# EAGLE design smd_basic_dual_powerb (EAGLE 5.06)
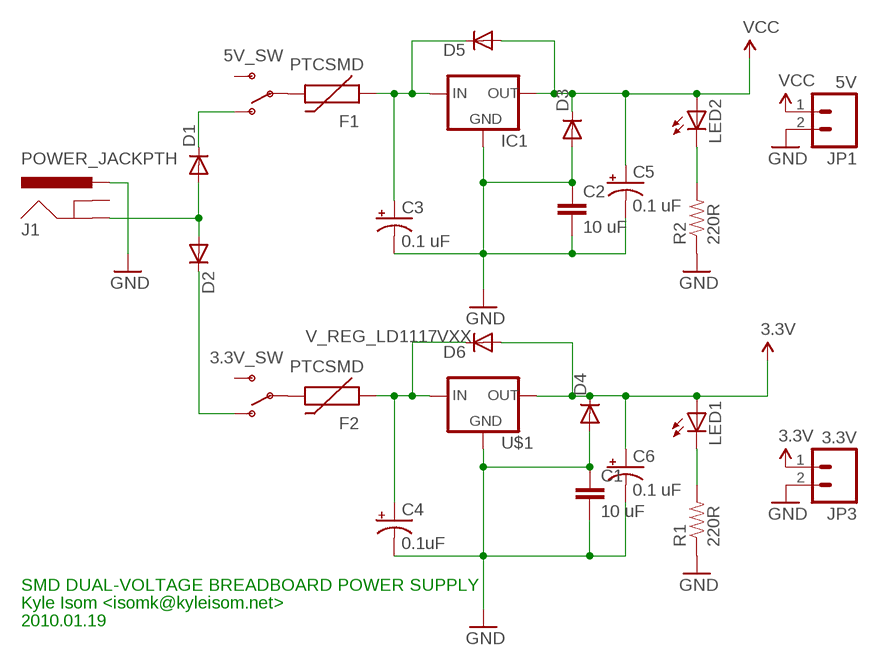
[diagram p0: schematic, sheet 1]

## Parts
3.3V_SW  SWITCH-SPSTPTH  [SWITCH-SPDT]
5V_SW  SWITCH-SPSTPTH  [SWITCH-SPDT]
C1  10 uF  CAP0603-CAP  [0603-CAP]
C2  10 uF  CAP0603-CAP  [0603-CAP]
C3  0.1 uF  CAP_POL1206  [EIA3216]
C4  0.1uF  CAP_POL1206  [EIA3216]
C5  0.1 uF  CAP_POL1206  [EIA3216]
C6  0.1 uF  CAP_POL1206  [EIA3216]
D1  DIODESOD  [SOD-323]
D2  DIODESOD  [SOD-323]
D3  DIODESOD  [SOD-323]
D4  DIODESOD  [SOD-323]
D5  DIODESOD  [SOD-323]
D6  DIODESOD  [SOD-323]
F1  PTCSMD  [PTC-1206]
F2  PTCSMD  [PTC-1206]
IC1  V_REG_78XXSIDE  [78XXL]
J1  POWER_JACKPTH  [POWER_JACK_PTH]
JP1  5V  M02  [1X02_LONGPADS]
JP3  3.3V  M02  [1X02_LONGPADS]
LED1  LEDCHIP-LED0603  [CHIP-LED0603]
LED2  LEDCHIP-LED0603  [CHIP-LED0603]
R1  220R  RESISTOR0603-RES  [0603-RES]
R2  220R  RESISTOR0603-RES  [0603-RES]
U$1  V_REG_LD1117VXX  [78XXL]

## Nets
3.3V: C6.A(+) D4.1(C) D6.2(A) JP3.1 LED1.A U$1.GND(OUT)
GND: C1.1 C1.2 C2.1 C2.2 C3.C(-) C4.C(-) C5.C(-) C6.C(-) D3.2(A) D4.2(A) IC1.GND J1.PWR JP1.2 JP3.2 R1.1 R2.1 U$1.IN(GND)
N$1: D1.2(A) D2.2(A) J1.GND
N$2: 5V_SW.2(P) F1.2
N$3: 3.3V_SW.2(P) F2.2
N$4: 5V_SW.1(O) D1.1(C)
N$5: 3.3V_SW.1(O) D2.1(C)
N$6: C3.A(+) D5.1(C) F1.1 IC1.IN
N$7: C4.A(+) D6.1(C) F2.1 U$1.OUT(IN)
N$12: LED2.C R2.2
N$14: LED1.C R1.2
VCC: C5.A(+) D3.1(C) D5.2(A) IC1.OUT JP1.1 LED2.A
Unconnected: 3.3V_SW.3(S) 5V_SW.3(S) J1.GNDBREAK

## Notes on the sheet
- SMD DUAL-VOLTAGE BREADBOARD POWER SUPPLY
- Kyle Isom <isomk@kyleisom.net>
- 2010.01.19

## Library data of the parts
3.3V_SW 5V_SW = SparkFun:SWITCH-SPST: SPST Switch Simple slide switch. Spark Fun Electronics SKU : COM-00102
C1 C2 = SparkFun:CAP: Capacitor Standard 0603 ceramic capacitor, and 0.1" leaded capacitor.
C3-C6 = SparkFun:CAP_POL: Capacitor Polarized These are standard SMD and PTH capacitors. Normally 10uF, 47uF, and 100uF in electrolytic and tantalum varieties. Always verify the external diameter of the through hole cap, it varies with capacity, voltage, and manufacturer. The EIA devices should be standard.
D1-D6 = SparkFun:DIODE: Diode These are standard reverse protection diodes and small signal diodes. SMA package can handle up to about 1A. SOD-323 can handle about 200mA. What the SOD-323 package when ordering, there are some mfgs out there that are 5-pin packages.
F1 F2 = SparkFun:PTC: Resettable Fuse PTC Resettable Fuse. Spark Fun Electronics SKU : COM-08357
IC1 = SparkFun:V_REG_78XX: Voltage Regulator Standard 7805 5V regulator. IGO (Input Ground Output). Spark Fun Electronics SKU : COM-00107
J1 = SparkFun:POWER_JACK: Power Jack This is the standard 5.5mm barrel jack for power. The PTH is the most common, proven, reliable, footprint. All others are experimental. The Slot footprint only works if the mill layer is transmitted to the PCB fab house so be warned. Spark Fun Electronics SKU : PRT-00119. Mating wall wart : TOL-00298 (and others)
JP1 JP3 = SparkFun:M02: Header 2 Standard 2-pin 0.1" header. Use with straight break away headers (SKU : PRT-00116), right angle break away headers (PRT-00553), swiss pins (PRT-00743), machine pins (PRT-00117), and female headers (PRT-00115). Molex polarized connector foot print use with SKU : PRT-08233 with associated crimp pins and housings.
LED1 LED2 = led:LED: LED OSRAM: - CHIPLED LG R971, LG N971, LY N971, LG Q971, LY Q971, LO R971, LY R971 LH N974, LH R974 LS Q976, LO Q976, LY Q976 LO Q996 - Hyper CHIPLED LW Q18S LB Q993, LB Q99A, LB R99A - SideLED LS A670, LO A670, LY A670, LG A670, LP A670 LB A673, LV A673, LT A673, LW A673 LH A674 LY A675 LS A676, LA A676, LO A676, LY A676, LW A676 LS A679, LY A679, LG A679 - Hyper Micro SIDELED® LS Y876, LA Y876, LO Y876, LY Y876 LT Y87S - SmartLED LW L88C, LW L88S LB L89C, LB L89S, LG L890 LS L89K, LO L89K, LY L89K LS L896, LA L896, LO L896, LY L896 - TOPLED LS T670, LO T670, LY T670, LG T670, LP T670 LSG T670, LSP T670, LSY T670, LOP T670, LYG T670 LG T671, LOG T671, LSG T671 LB T673, LV T673, LT T673, LW T673 LH T674 LS T676, LA T676, LO T676, LY T676, LB T676, LH T676, LSB T676, LW T676 LB T67C, LV T67C, LT T67C, LS T67K, LO T67K, LY T67K, LW E67C LS E67B, LA E67B, LO E67B, LY E67B, LB E67C, LV E67C, LT E67C LW T67C LS T679, LY T679, LG T679 LS T770, LO T770, LY T770, LG T770, LP T770 LB T773, LV T773, LT T773, LW T773 LH T774 LS E675, LA E675, LY E675, LS T675 LS T776, LA T776, LO T776, LY T776, LB T776 LHGB T686 LT T68C, LB T68C - Hyper Mini TOPLED® LB M676 - Mini TOPLED Santana® LG M470 LS M47K, LO M47K, LY M47K Source: http://www.osram.convergy.de LUXEON: - LUMILED® LXK2-PW12-R00, LXK2-PW12-S00, LXK2-PW14-U00, LXK2-PW14-V00 LXK2-PM12-R00, LXK2-PM12-S00, LXK2-PM14-U00 LXK2-PE12-Q00, LXK2-PE12-R00, LXK2-PE12-S00, LXK2-PE14-T00, LXK2-PE14-U00 LXK2-PB12-K00, LXK2-PB12-L00, LXK2-PB12-M00, LXK2-PB14-N00, LXK2-PB14-P00, LXK2-PB14-Q00 LXK2-PR12-L00, LXK2-PR12-M00, LXK2-PR14-Q00, LXK2-PR14-R00 LXK2-PD12-Q00, LXK2-PD12-R00, LXK2-PD12-S00 LXK2-PH12-R00, LXK2-PH12-S00 LXK2-PL12-P00, LXK2-PL12-Q00, LXK2-PL12-R00 Source: www.luxeon.com KINGBRIGHT: KA-3528ASYC Source: www.kingbright.com
R1 R2 = SparkFun:RESISTOR: Resistor Basic schematic elements and footprints for 0603, 1206, and PTH 1/10th watt (small) resistors.
U$1 = SparkFun:V_REG_LD1117VXX: LD1117VXX voltage regulator. We carry the 3.3V version (COM-00526) in TO-220 package.

## Board
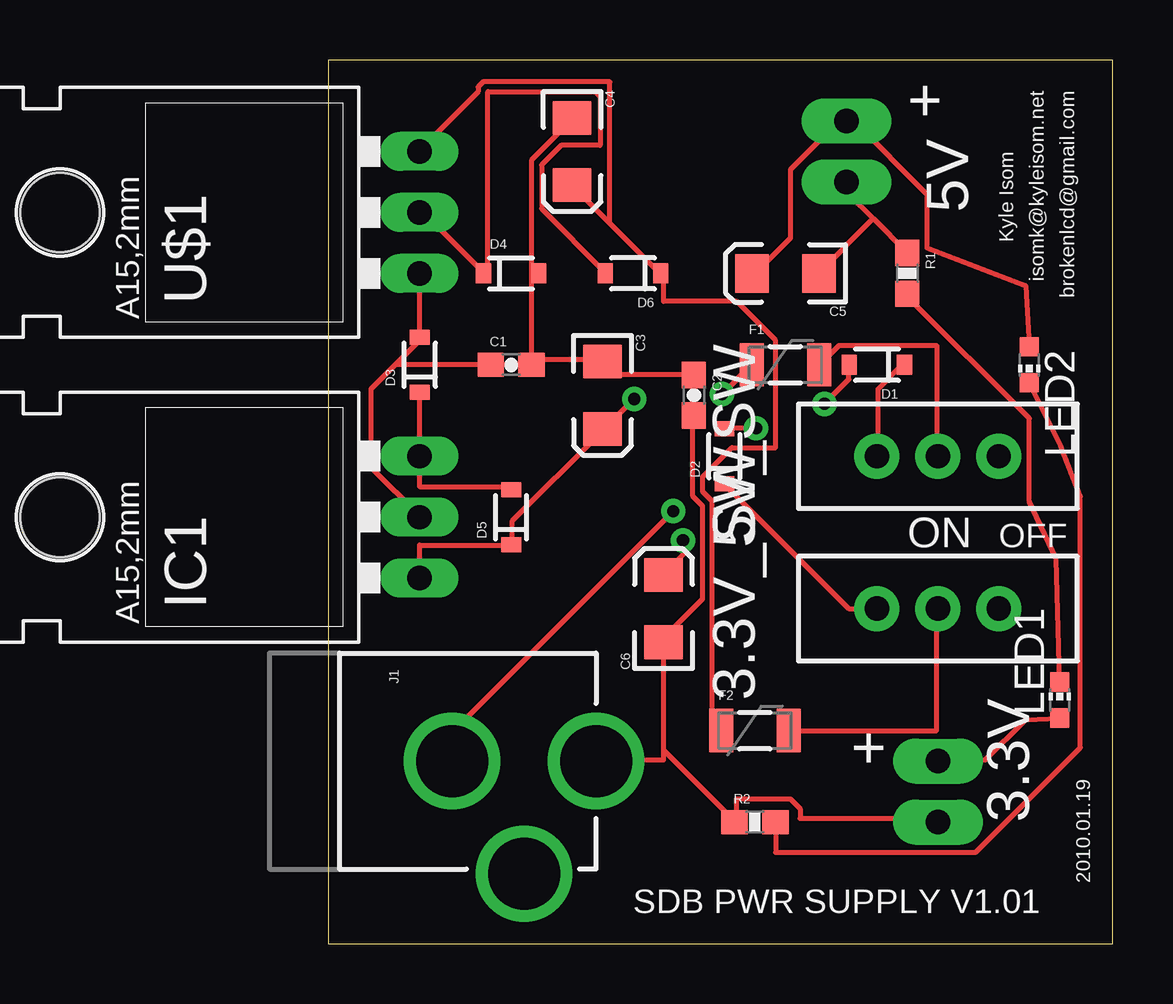
[diagram p1: board, top side]
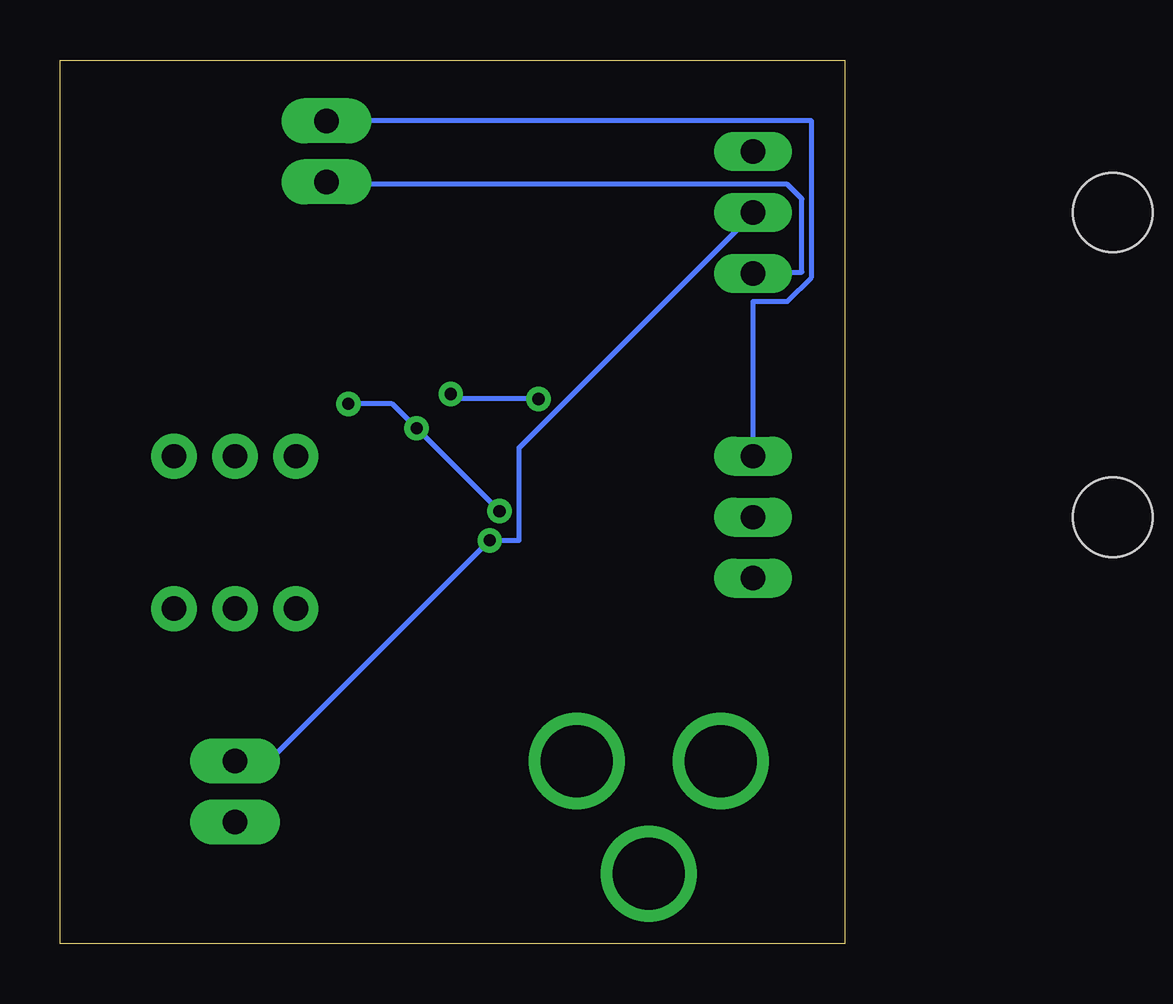
[diagram p2: board, bottom side, seen from below]

Size 32.69 x 36.83 mm. Coordinates in mm from the lower left corner, seen from the top.
Outline: 0,0 32.69,0 32.69,36.82 31.75,36.82 31.75,36.83 0,36.82 0,0
Copper layers (1*16): Top 0.035mm / dielectric 1.5mm / Bottom 0.035mm
Design rules "SparkFun": minimum track width 8mil, minimum drill 20mil, track to track 8mil, track to pad 8mil, pad to pad 8mil, via to via 8mil, smd to smd 8mil, copper to edge 10mil, drill to drill 8mil, minimum pad ring 12mil, minimum via ring 10mil, stop-mask expansion 4mil, vias tented up to drill 25mil, thermal gap 10mil

### Footprints (pad centres in the part's own frame; a part is rotated, then mirrored left to right if it is on the bottom)
SWITCH-SPDT = drill 1.016 pad 1.88 round: 1 0,2.54; 2 0,0; 3 0,-2.54
0603-CAP = smd 1.1 x 1: 1 -0.85,0; 2 0.85,0
EIA3216 = smd 1.4 x 1.6: A 1.4,0; C -1.4,0
SOD-323 = smd 0.63 x 0.83: 1 -1.15,0; 2 1.15,0
PTC-1206 = smd 1 x 1.8: 1 -1.4,0; 2 1.4,0
78XXL = drill 1.016 long: GND 0,-3.81; IN -2.54,-3.81; OUT 2.54,-3.81 | hole 3.302: 0,11.176
POWER_JACK_PTH = drill 2.997 round: GND 0,7.7; GNDBREAK 4.7,10.7; PWR 0,13.7
1X02_LONGPADS = drill 1.016 pad 1.88 long: 1 0,0; 2 2.54,0
CHIP-LED0603 = smd 0.8 x 0.8: A 0,-0.75; C 0,0.75
0603-RES = smd 1.1 x 1: 1 -0.85,0; 2 0.85,0

### Placement (x,y rotation side)
3.3V_SW  25.4,13.97 90 top
5V_SW  25.4,20.32 90 top
C1  7.62,24.13 0 top
C2  15.24,22.86 270 top
C3  11.43,22.86 270 top
C4  10.16,33.02 270 top
C5  19.05,27.94 180 top
C6  13.97,13.97 90 top
D1  22.86,24.13 180 top
D2  16.51,20.32 90 top
D3  3.81,24.13 90 top
D4  7.62,27.94 0 top
D5  7.62,17.78 90 top
D6  12.7,27.94 180 top
F1  19.05,24.13 0 top
F2  17.78,8.89 0 top
IC1  0,17.78 90 top
J1  -2.54,7.62 270 top
JP1  21.59,34.29 270 top
JP3  25.4,7.62 270 top
LED1  30.48,10.16 0 top
LED2  29.21,24.13 180 top
R1  24.13,27.94 270 top
R2  17.78,5.08 0 top
U$1  0,30.48 90 top

### Tracks (layer width: path | path; a pad name or v marks a point on that pad's centre or on a via)
3.3V  (via drill 0.51)
  Top 0.203: U$1.GND 3.81,30.63 6.45,27.99 D4.1 6.66,27.99 6.66,35.51 11.12,35.51 11.33,35.31 11.33,33.27 9.7,33.27 8.89,32.46 8.89,30.63 11.53,27.99 D6.2 | LED1.A 29.06,9.35 27.38,7.67 25.55,7.67 JP3.1 | v14.78,16.82 14.78,16.2 13.97,15.39 C6.A
  Bottom 0.203: JP3.1 25.35,7.67 23.93,7.67 v14.78,16.82 13.56,16.82 13.56,20.68 3.81,30.43 U$1.GND
GND
  Top 0.203: 13.97,8.08 16.82,5.23 R2.1 17.02,5.23 17.02,6.04 19.25,6.04 19.66,5.64 19.66,5.23 25.35,5.23 JP3.2 | 13.97,8.08 C6.C 13.97,12.75 15.6,14.38 15.6,18.24 15.19,18.64 15.19,21.89 C2.2 15.19,22.1 15.19,23.52 C2.1 15.19,23.72 11.53,23.72 11.53,24.13 C3.C 11.33,24.33 8.48,24.33 | 13.97,8.08 13.97,7.67 9.91,7.67 J1.PWR | 8.48,27.58 8.69,27.79 D4.2 8.48,27.58 | 8.48,24.33 8.48,24.13 C1.2 | 8.48,24.33 8.48,27.58 | C1.2 C1.1 2.79,24.13 | 8.48,24.33 C1.2 | 8.48,27.58 8.48,32.66 10.11,34.29 C4.C | 22.71,30.23 21.69,31.24 21.69,31.65 JP1.2 | 22.71,30.23 24.13,28.8 R1.1 | 22.71,30.23 20.47,27.99 C5.C | U$1.IN D3.2 3.81,25.15 2.79,24.13 | 2.79,24.13 1.78,23.11 1.78,19.86 3.81,17.83 IC1.GND
  Bottom 0.203: JP1.2 21.49,31.65 2.39,31.65 1.78,31.04 1.78,27.99 3.81,27.99 U$1.IN
N$1  (via drill 0.51)
  Top 0.203: v17.83,21.49 16.61,21.49 D2.2 | v20.68,22.5 21.69,23.52 21.69,24.13 D1.2 | v14.38,18.03 4.01,7.67 J1.GND
  Bottom 0.203: v20.68,22.5 18.85,22.5 v17.83,21.49 v14.38,18.03
N$2
  Top 0.203: F1.2 20.47,24.13 21.29,24.94 25.35,24.94 25.35,20.47 5V_SW.2
N$3
  Top 0.203: F2.2 25.35,8.89 25.35,13.97 3.3V_SW.2
N$4
  Top 0.203: D1.1 23.93,24.13 22.91,23.11 22.91,20.47 5V_SW.1
N$5
  Top 0.203: D2.1 16.61,19.05 21.69,13.97 3.3V_SW.1
N$6  (via drill 0.51)
  Top 0.203: IC1.IN 3.81,16.61 7.47,16.61 D5.1 7.67,16.82 7.67,17.63 11.33,21.29 C3.A 11.53,21.49 v12.75,22.71 | v16.41,22.91 17.63,24.13 F1.1
  Bottom 0.203: v16.41,22.91 16.2,22.71 v12.75,22.71
N$7
  Top 0.203: 11.73,30.02 10.31,31.45 C4.A | 11.73,30.02 13.77,27.99 D6.1 13.97,27.79 13.97,26.77 17.02,26.77 18.64,25.15 18.64,20.68 16.82,20.68 15.6,19.46 15.6,18.85 16,18.44 16,9.09 16.2,8.89 F2.1 | 11.73,30.02 11.73,35.92 6.45,35.92 6.25,35.71 6.25,35.51 3.81,33.07 U$1.OUT
N$12
  Top 0.203: LED2.C 30.53,20.73 31.34,18.64 31.34,8.18 26.98,3.81 18.64,3.81 18.64,5.03 R2.2
N$14
  Top 0.203: LED1.C 30.33,16.05 29.21,18.44 29.21,21.89 24.13,26.98 R1.2
VCC
  Top 0.203: D3.1 IC1.OUT 3.81,19.05 7.47,19.05 D5.2 | LED2.A 29.06,27.43 24.94,29.01 24.94,31.24 21.89,34.29 JP1.1 21.29,34.29 19.25,32.26 19.25,29.41 17.83,27.99 C5.A
  Bottom 0.203: IC1.OUT 3.81,26.77 2.39,26.77 1.37,27.79 1.37,34.29 JP1.1

### Text on the board
tPlace: isomk@kyleisom.net | brokenlcd@gmail.com | + | Kyle Isom | 5V | ON | OFF | + | 3.3V | 2010.01.19 | SDB PWR SUPPLY V1.01